# EAGLE design buffer (EAGLE 9.6.2)
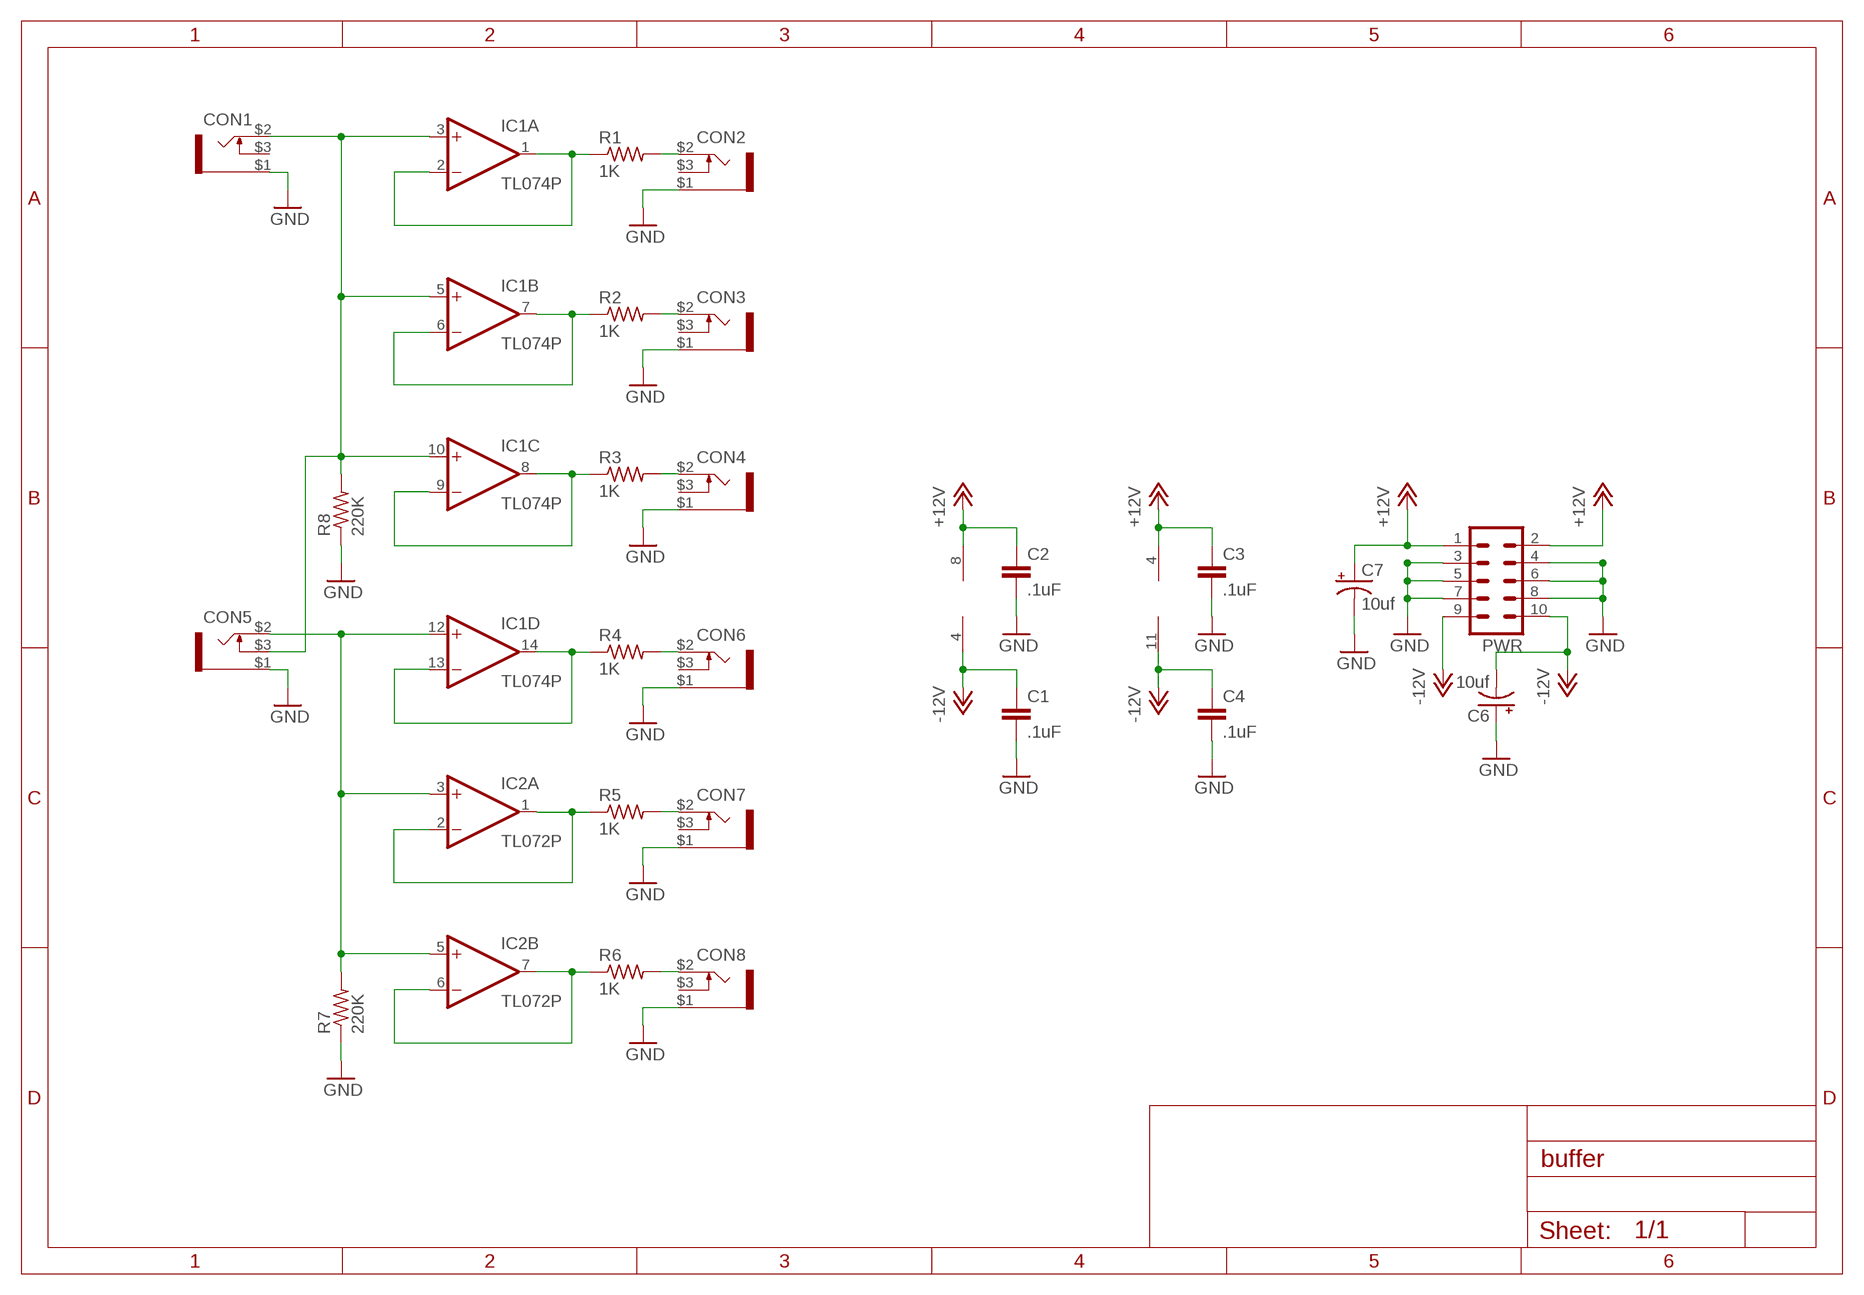
[diagram p0: schematic, sheet 1]

## Parts
C1  .1uF  C-EU050-024X044  [C050-024X044]
C2  .1uF  C-EU050-024X044  [C050-024X044]
C3  .1uF  C-EU050-024X044  [C050-024X044]
C4  .1uF  C-EU050-024X044  [C050-024X044]
C6  10uf  CPOL-USE2.5-5  [E2,5-5]
C7  10uf  CPOL-USE2.5-5  [E2,5-5]
CON1  PJ-323PJ-323  [PJ-323]
CON2  PJ-323PJ-323  [PJ-323]
CON3  PJ-323PJ-323  [PJ-323]
CON4  PJ-323PJ-323  [PJ-323]
CON5  PJ-323PJ-323  [PJ-323]
CON6  PJ-323PJ-323  [PJ-323]
CON7  PJ-323PJ-323  [PJ-323]
CON8  PJ-323PJ-323  [PJ-323]
IC1  TL074P  [DIL14]
IC2  TL072P  [DIL08]
PWR  ML10  [ML10]
R1  1K  R-US_0207/2V  [0207/2V]
R2  1K  R-US_0207/2V  [0207/2V]
R3  1K  R-US_0207/2V  [0207/2V]
R4  1K  R-US_0207/2V  [0207/2V]
R5  1K  R-US_0207/2V  [0207/2V]
R6  1K  R-US_0207/2V  [0207/2V]
R7  220K  R-US_0207/2V  [0207/2V]
R8  220K  R-US_0207/2V  [0207/2V]

## Nets
+12V: C2.1 C3.1 C7.+ IC1.4(P:V+) IC2.8(P:V+) PWR.1 PWR.2
-12V: C1.1 C4.1 C6.- IC1.11(P:V-) IC2.4(P:V-) PWR.9 PWR.10
GND: C1.2 C2.2 C3.2 C4.2 C6.+ C7.- CON1.$1 CON2.$1 CON3.$1 CON4.$1 CON5.$1 CON6.$1 CON7.$1 CON8.$1 PWR.3 PWR.4 PWR.5 PWR.6 PWR.7 PWR.8 R7.1 R8.1
N$1: CON1.$2 CON5.$3 IC1.3(A:+IN) IC1.5(B:+IN) IC1.10(C:+IN) R8.2
N$2: IC1.8(C:OUT) IC1.9(C:-IN) R3.1
N$3: IC1.6(B:-IN) IC1.7(B:OUT) R2.1
N$4: IC1.1(A:OUT) IC1.2(A:-IN) R1.1
N$5: CON5.$2 IC1.12(D:+IN) IC2.3(A:+IN) IC2.5(B:+IN) R7.2
N$6: CON4.$2 R3.2
N$7: CON6.$2 R4.2
N$8: IC1.13(D:-IN) IC1.14(D:OUT) R4.1
N$9: IC2.1(A:OUT) IC2.2(A:-IN) R5.1
N$10: IC2.6(B:-IN) IC2.7(B:OUT) R6.1
N$11: CON7.$2 R5.2
N$12: CON3.$2 R2.2
N$13: CON2.$2 R1.2
N$14: CON8.$2 R6.2
Unconnected: CON1.$3 CON2.$3 CON3.$3 CON4.$3 CON6.$3 CON7.$3 CON8.$3

## Library data of the parts
C1-C4 = resistor:C-EU: CAPACITOR, European symbol
C6 C7 = resistor:CPOL-US: POLARIZED CAPACITOR, American symbol
CON1-CON8 = gerbster:PJ-323
IC1 = linear:TL074: OP AMP
IC2 = TomW:TL072: OP AMP
PWR = con-ml:ML10: HARTING; OC_FARNELL: unknown; OC_NEWARK: unknown
R1-R8 = resistor:R-US_: RESISTOR, American symbol

## Board
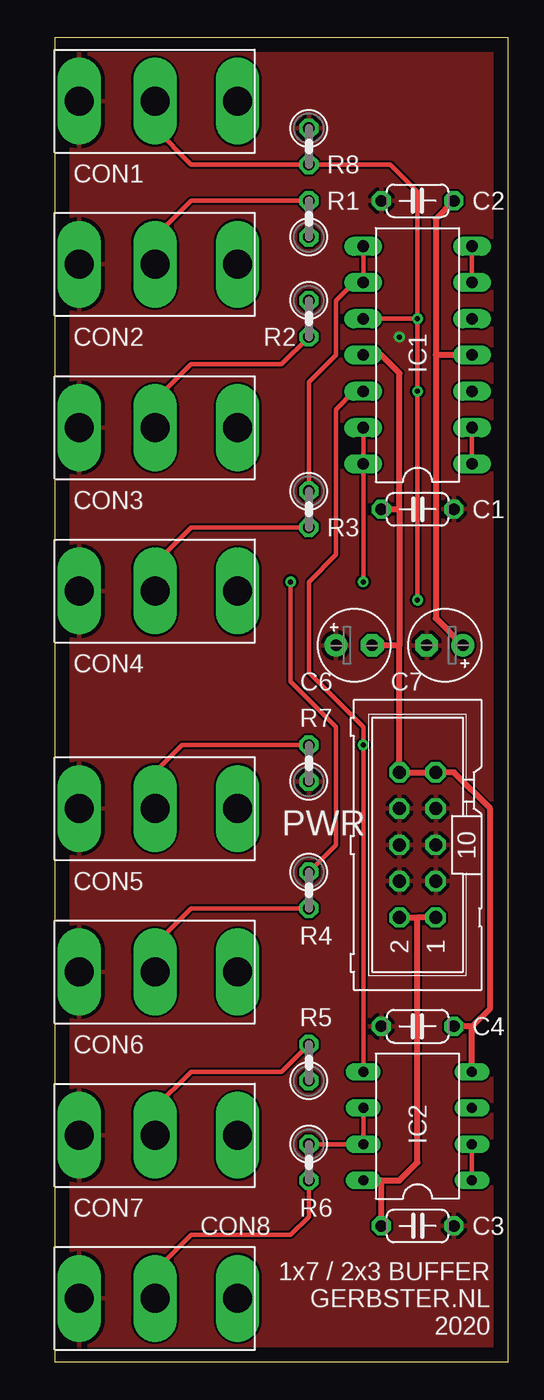
[diagram p1: board, top side]
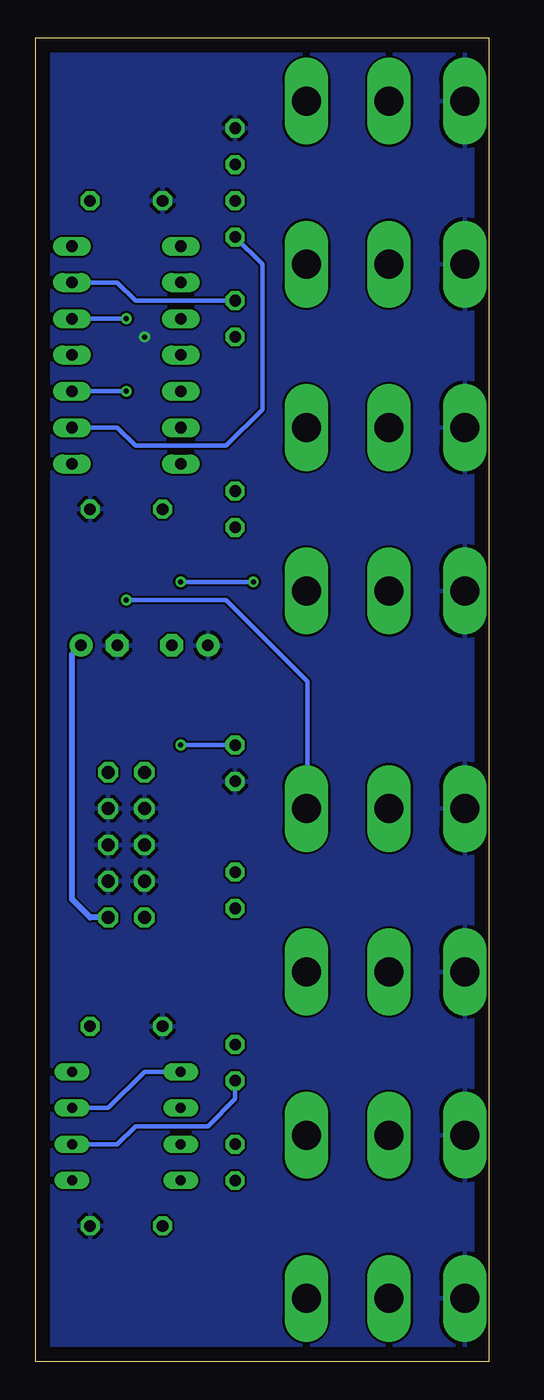
[diagram p2: board, bottom side, seen from below]

Size 31.75 x 92.71 mm. Coordinates in mm from the lower left corner, seen from the top.
Outline: 0,0 31.75,0 31.75,92.71 0,92.7 0,0
Copper layers (1*16): Top 0.035mm / dielectric 1.5mm / Bottom 0.035mm
Design rules "default": minimum track width 6mil, minimum drill 0.35mm, track to track 6mil, track to pad 6mil, pad to pad 6mil, via to via 6mil, smd to smd 6mil, copper to edge 40mil, drill to drill 6mil, minimum pad ring 10mil, minimum via ring 8mil, stop-mask expansion 4mil, vias tented up to drill 0mil, thermal gap 10mil

### Footprints (pad centres in the part's own frame; a part is rotated, then mirrored left to right if it is on the bottom)
C050-024X044 = drill 0.813 octagon: 1 -2.54,0; 2 2.54,0
E2,5-5 = drill 0.813 pad 1.6: + -1.27,0 | drill 0.813 pad 1.6 octagon: - 1.27,0
PJ-323 = drill 2.032 pad 2.54 long: $1 0,-1.7; $2 0,-7; $3 0,-12.8
DIL14 = drill 0.813 long: 1 -7.62,-3.81; 2 -5.08,-3.81; 3 -2.54,-3.81; 4 0,-3.81; 5 2.54,-3.81; 6 5.08,-3.81; 7 7.62,-3.81; 8 7.62,3.81; 9 5.08,3.81; 10 2.54,3.81; 11 0,3.81; 12 -2.54,3.81; 13 -5.08,3.81; 14 -7.62,3.81
DIL08 = drill 0.7 long: 1 -3.81,-3.81; 2 -1.27,-3.81; 3 1.27,-3.81; 4 3.81,-3.81; 5 3.81,3.81; 6 1.27,3.81; 7 -1.27,3.81; 8 -3.81,3.81
ML10 = drill 0.914 octagon: 1 -5.08,-1.27; 2 -5.08,1.27; 3 -2.54,-1.27; 4 -2.54,1.27; 5 0,-1.27; 6 0,1.27; 7 2.54,-1.27; 8 2.54,1.27; 9 5.08,-1.27; 10 5.08,1.27
0207/2V = drill 0.813 octagon: 1 -1.27,0; 2 1.27,0

### Placement (x,y rotation side)
C1  25.4,59.69 0 top
C2  25.4,81.28 180 top
C3  25.4,9.53 0 top
C4  25.4,23.5 180 top
C6  20.95,50.16 0 top
C7  27.3,50.16 180 top
CON1  0,88.27 90 top
CON2  0,76.83 90 top
CON3  0,65.41 90 top
CON4  0,53.98 90 top
CON5  0,38.73 90 top
CON6  0,27.3 90 top
CON7  0,15.88 90 top
CON8  0,4.45 90 top
IC1  25.4,70.48 90 top
IC2  25.4,16.51 90 top
PWR  25.4,36.2 90 top
R1  17.78,80.01 90 top
R2  17.78,73.03 270 top
R3  17.78,59.69 270 top
R4  17.78,33.02 270 top
R5  17.78,20.95 90 top
R6  17.78,13.97 270 top
R7  17.78,41.91 90 top
R8  17.78,85.09 270 top

### Tracks (layer width: path | path; a pad name or v marks a point on that pad's centre or on a via)
+12V
  Top 0.406: C3.1 22.86,12.7 | 22.86,12.7 IC2.8 | 22.86,12.7 24.13,12.7 25.4,13.97 25.4,31.11 | PWR.2 25.4,31.11 | C2.1 26.67,80.01 26.67,70.48 | IC1.4 26.67,70.48 | 26.67,70.48 26.67,52.07 C7.+ | PWR.1 25.4,31.11
  Bottom 0.406: C7.+ 29.21,49.53 29.21,32.38 27.94,31.11 PWR.1
-12V
  Top 0.406: 24.13,50.16 PWR.10 PWR.9 27.94,41.27 30.48,38.73 30.48,24.77 29.21,23.5 | C1.1 24.13,59.69 | 24.13,59.69 24.13,69.22 22.86,70.48 IC1.11 | 24.13,59.69 24.13,50.16 | 24.13,50.16 C6.- | IC2.4 29.21,23.5 | 29.21,23.5 C4.1
GND  (via drill 0.35)
  other vias: 24.13,71.75
  pour Top: 0,0 31.75,0 31.75,92.71 0,92.71
  pour Bottom: 0,0 31.75,0 31.75,92.71 0,92.71
N$1  (via drill 0.35)
  Top 0.305: CON1.$2 7,86.36 9.54,83.82 R8.2 23.5,83.82 25.4,81.92 v25.4,73.03 | v25.4,73.03 IC1.10 | v25.4,73.03 v25.4,67.94 v25.4,53.34
  Bottom 0.305: IC1.5 v25.4,73.03 | IC1.3 v25.4,67.94 | v25.4,53.34 18.41,53.34 12.7,47.62 12.7,38.53 CON5.$3
N$2
  Top 0.305: IC1.8 IC1.9 20.95,75.56 19.68,74.3 19.68,70.48 17.78,68.58 R3.1
N$3
  Top 0.305: IC1.7 IC1.6
  Bottom 0.305: IC1.6 26.04,75.56 24.77,74.3 R2.1
N$4
  Top 0.305: IC1.1 IC1.2
  Bottom 0.305: R1.1 15.88,76.83 15.88,66.67 18.41,64.14 24.77,64.14 26.04,65.41 IC1.2
N$5  (via drill 0.35)
  Top 0.305: CON5.$2 7,41.29 8.89,43.18 R7.2 | IC2.5 v21.59,43.18 21.59,44.45 17.78,48.26 17.78,54.61 19.68,56.52 19.68,66.67 20.95,67.94 IC1.12
  Bottom 0.305: IC2.3 26.67,17.78 24.13,20.32 IC2.5 | v21.59,43.18 R7.2
N$6
  Top 0.305: CON4.$2 7,55.9 9.53,58.42 R3.2
N$7
  Top 0.305: CON6.$2 7,29.23 9.53,31.75 R4.2
N$8  (via drill 0.35)
  Top 0.305: IC1.13 IC1.14 v21.59,54.61 | v16.51,54.61 16.51,47.62 19.68,44.45 19.68,36.2 R4.1
  Bottom 0.305: v21.59,54.61 v16.51,54.61
N$9
  Top 0.305: IC2.1 IC2.2
  Bottom 0.305: R5.1 17.78,18.41 19.68,16.51 24.77,16.51 26.04,15.24 IC2.2
N$10
  Top 0.305: IC2.6 IC2.7 R6.1
N$11
  Top 0.305: CON7.$2 6.99,15.89 6.99,17.78 9.53,20.32 15.88,20.32 R5.2
N$12
  Top 0.305: CON3.$2 7,67.33 9.53,69.85 15.88,69.85 R2.2
N$13
  Top 0.305: R1.2 9.53,81.28 7,78.75 CON2.$2
N$14
  Top 0.305: CON8.$2 6.99,4.46 6.99,6.35 9.53,8.89 16.51,8.89 17.78,10.16 R6.2

### Text on the board
tNames: 1x7 / 2x3 BUFFER / GERBSTER.NL / 2020